# EAGLE design Led_Switch (EAGLE 4.16)
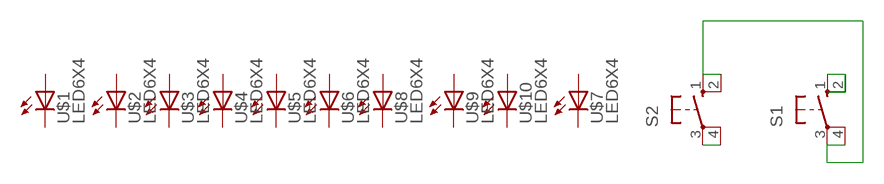
[diagram p0: schematic, sheet 1]

## Parts
S1  10-XX  [B3F-10XX]
S2  10-XX  [B3F-10XX]
U$1  LED6X4  [LED6X4]
U$2  LED6X4  [LED6X4]
U$3  LED6X4  [LED6X4]
U$4  LED6X4  [LED6X4]
U$5  LED6X4  [LED6X4]
U$6  LED6X4  [LED6X4]
U$7  LED6X4  [LED6X4]
U$8  LED6X4  [LED6X4]
U$9  LED6X4  [LED6X4]
U$10  LED6X4  [LED6X4]

## Nets
N$2: S1.3(P) S1.4(P1) S2.1(S) S2.2(S1)
N$3: S1.1(S) S1.2(S1)
N$4: S2.3(P) S2.4(P1)
Unconnected: U$1.P$1(A) U$1.P$2(C) U$2.P$1(A) U$2.P$2(C) U$3.P$1(A) U$3.P$2(C) U$4.P$1(A) U$4.P$2(C) U$5.P$1(A) U$5.P$2(C) U$6.P$1(A) U$6.P$2(C) U$7.P$1(A) U$7.P$2(C) U$8.P$1(A) U$8.P$2(C) U$9.P$1(A) U$9.P$2(C) U$10.P$1(A) U$10.P$2(C)

## Library data of the parts
S1 S2 = switch-omron:10-XX: OMRON SWITCH
U$1-U$10 = ZStofer:LED6X4

## Board
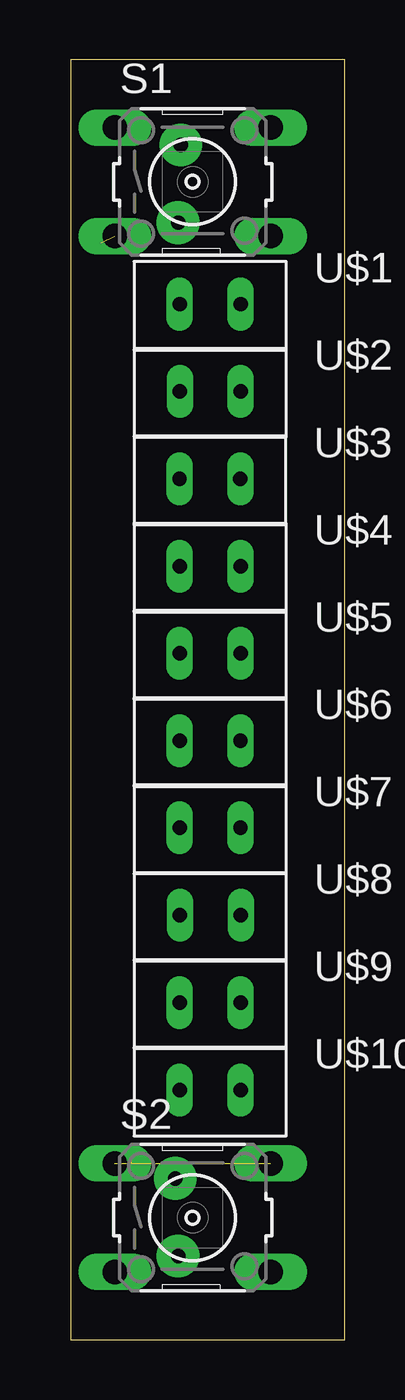
[diagram p1: board, top side]
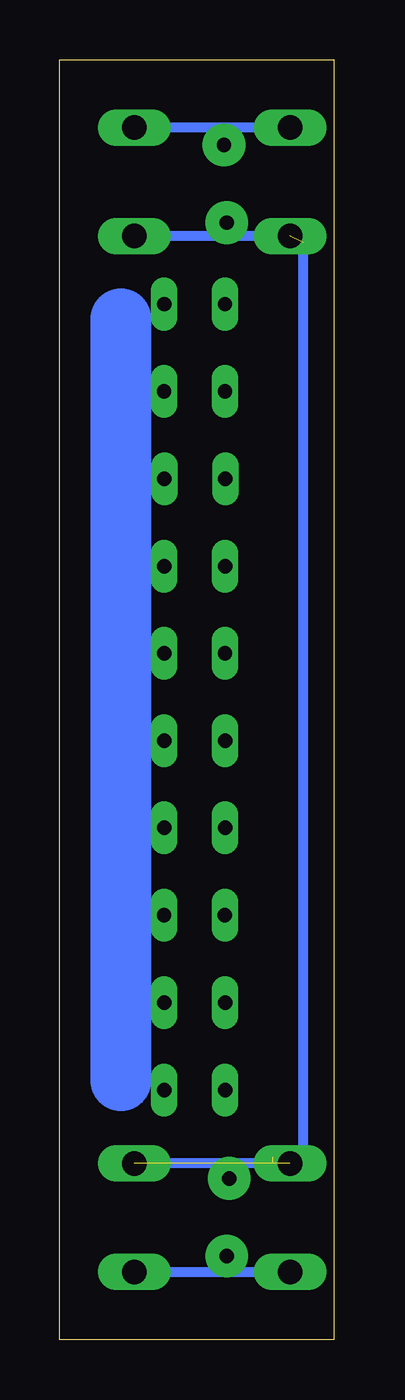
[diagram p2: board, bottom side, seen from below]

Size 11.43 x 53.34 mm. Coordinates in mm from the lower left corner, seen from the top.
Outline: 0,0 11.43,0 11.43,53.34 0,53.34 0,0
Copper layers (1*2+15*16): Top 0.035mm / dielectric 0.2mm / Route2 0.035mm / dielectric 0.15mm / Route15 0.035mm / dielectric 0.2mm / Bottom 0.035mm
Design rules "default": minimum track width 10mil, minimum drill 24mil, track to track 8mil, track to pad 8mil, pad to pad 8mil, via to via 8mil, smd to smd 8mil, copper to edge 40mil, drill to drill 8mil, minimum pad ring 10mil, minimum via ring 8mil, stop-mask expansion 4mil, vias tented up to drill 0mil, thermal gap 10mil

### Footprints (pad centres in the part's own frame; a part is rotated, then mirrored left to right if it is on the bottom)
B3F-10XX = drill 1.016 long: 1 -3.251,2.261; 2 3.251,2.261; 3 -3.251,-2.261; 4 3.251,-2.261
LED6X4 = drill 0.6 long: P$1 1.905,1.905; P$2 4.445,1.905

### Placement (x,y rotation side)
S1  5.08,48.26 0 top
S2  5.08,5.08 0 top
U$1  2.64,41.25 0 top
U$2  2.64,37.61 0 top
U$3  2.63,33.97 0 top
U$4  2.63,30.33 0 top
U$5  2.64,26.7 0 top
U$6  2.63,23.06 0 top
U$7  2.63,19.43 0 top
U$8  2.64,15.78 0 top
U$9  2.63,12.14 0 top
U$10  2.63,8.49 0 top

### Tracks (layer width: path | path; a pad name or v marks a point on that pad's centre or on a via)
N$1
  Bottom 2.54: 8.89,42.55 8.89,10.79
N$2  (4 unrouted)
  Bottom 0.406: 8.89,46 S1.4 | S1.3 8.89,46 | 8.89,46 8.89,45.72 | S2.2 S2.1 1.27,7.34 | 1.27,7.34 1.27,7.62 | 1.27,7.34 1.27,45.72
N$3
  Bottom 0.406: 8.89,50.52 S1.2 | S1.1 8.89,50.52 | 8.89,50.52 8.89,50.8
N$4
  Bottom 0.406: S2.3 1.83,2.62 arc90 1.91,2.54 arc-90 2.18,2.82 S2.4
N$7  (via drill 0.6 pad 1.78)
  other vias: 4.59,49.79
N$8  (via drill 0.6 pad 1.78)
  other vias: 4.47,46.56
N$9  (via drill 0.6 pad 1.78)
  other vias: 4.36,6.72
N$10  (via drill 0.6 pad 1.78)
  other vias: 4.47,3.48